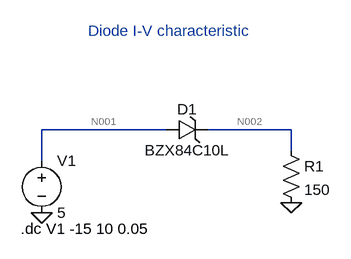
[diagram p0: schematic Zener.asc]
Zener.asc, the LTspice schematic file:
Version 4
SHEET 1 880 680
WIRE 208 208 16 208
WIRE 400 208 272 208
WIRE 400 240 400 208
WIRE 16 256 16 208
FLAG 16 336 0
FLAG 400 320 0
SYMBOL zener 208 224 R270
WINDOW 0 32 32 VTop 2
WINDOW 3 0 32 VBottom 2
SYMATTR InstName D1
SYMATTR Value BZX84C10L
SYMATTR Description Diode
SYMATTR Type diode
SYMBOL voltage 16 240 R0
SYMATTR InstName V1
SYMATTR Value 5
SYMBOL res 384 224 R0
SYMATTR InstName R1
SYMATTR Value 150
TEXT 88 56 Left 2 ;Diode I-V characteristic
TEXT -16 360 Left 2 !.dc V1 -15 10 0.05

The netlist it stands for:
* Zener.asc
D1 N001 N002 BZX84C10L
V1 N001 0 5
R1 N002 0 150
.model D D
.lib standard.dio
* Diode I-V characteristic
.dc V1 -15 10 0.05
.backanno
.end

* Results of the author's LTspice run, read from the files saved beside the schematic
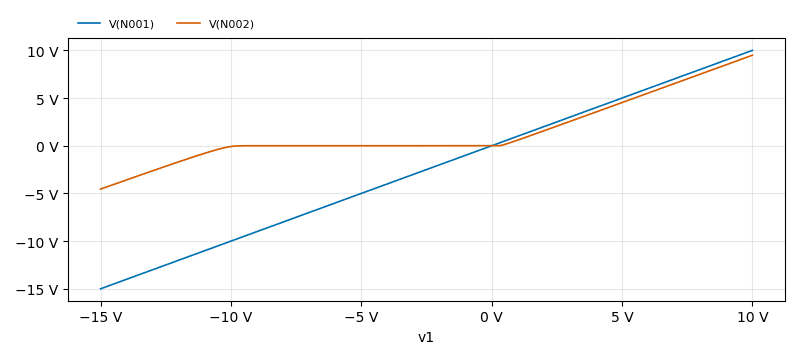
[diagram p1: DC transfer characteristic of Zener.asc, plotted from the saved traces]
* DC transfer characteristic, 1 run:
*   V(N001): -15 V at v1=-15 V, 10 V at v1=10 V, min -15 V, max 10 V
*   V(N002): -4.544 V at v1=-15 V, 9.491 V at v1=10 V, min -4.544 V, max 9.491 V